# EAGLE design Controller_2.3_Atmega2560 (EAGLE 7.7.0)
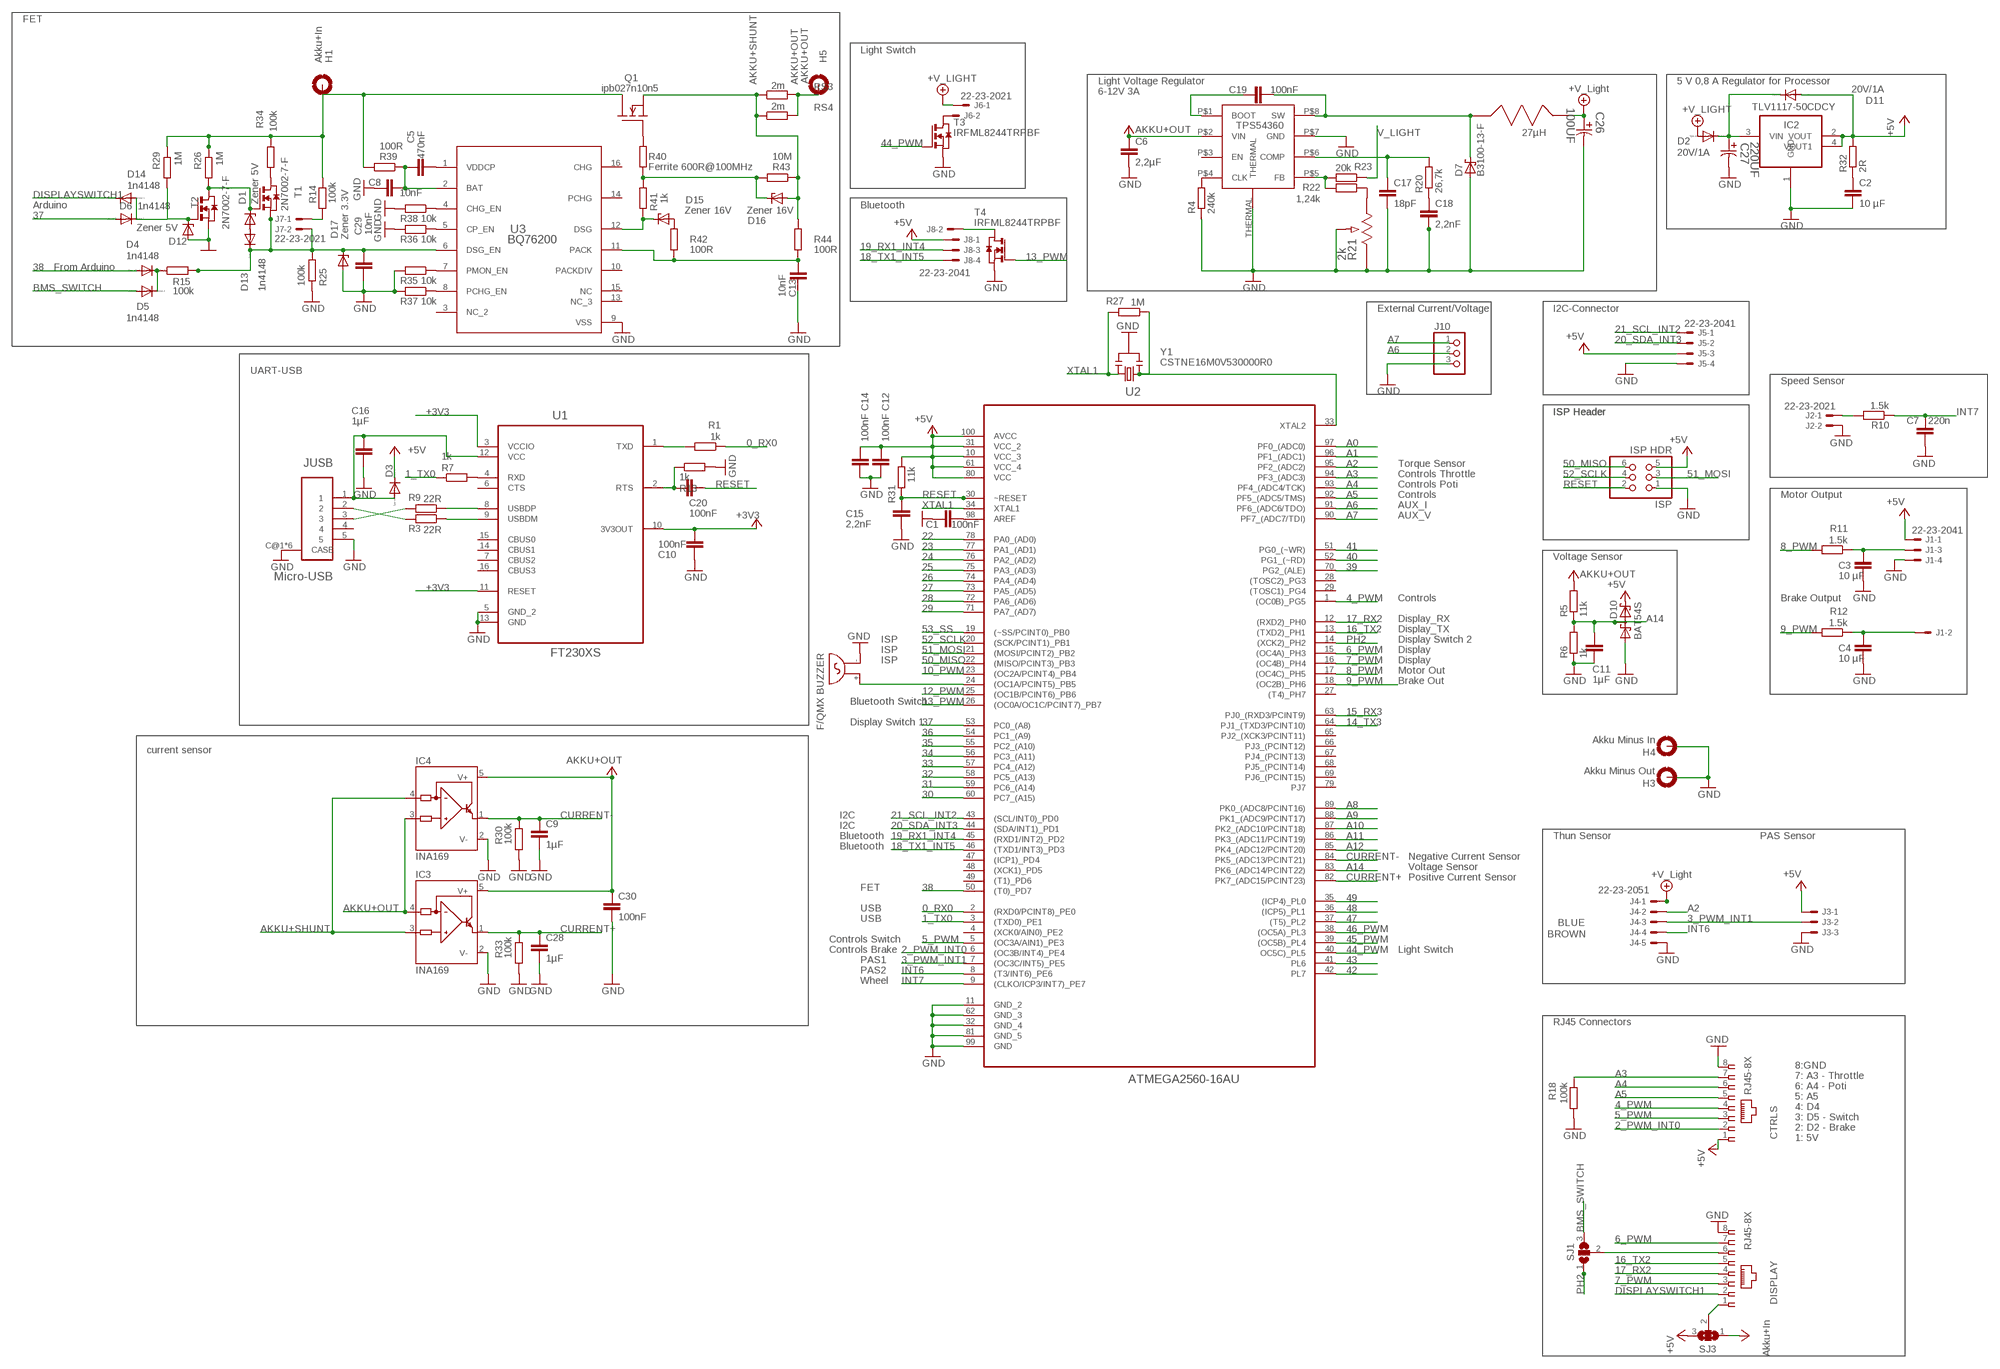
[diagram p0: schematic, sheet 1]

## Parts
BUZZER  F/QMX  [F/QMX]
C1  100nF  C-EUC0603  [C0603]
C2  10 µF  C-EUC1206  [C1206]
C3  10 µF  C-EUC1206  [C1206]
C4  10 µF  C-EUC1206  [C1206]
C5  470nF  C-EUC0603  [C0603]
C6  2,2µF  C-EUC1210  [C1210]
C7  220n  C-EUC0603  [C0603]
C8  10nF  C-EUC0603  [C0603]
C9  1µF  C-EUC0603  [C0603]
C10  100nF  C-EUC0603  [C0603]
C11  1µF  C-EUC0603  [C0603]
C12  100nF  C-EUC0603  [C0603]
C13  10nF  C-EUC0603  [C0603]
C14  100nF  C-EUC0603  [C0603]
C15  2,2nF  C-EUC0603  [C0603]
C16  1µF  C-EUC0603  [C0603]
C17  18pF  C-EUC0603  [C0603]
C18  2,2nF  C-EUC0603  [C0603]
C19  100nF  C-EUC0603  [C0603]
C20  100nF  C-EUC0603  [C0603]
C26  100UF  EEE-FPE101XAP-CASE-D8  [CAPAE660X800N]
C27  220UF  EEE-FPC221XAP-CASE-D8  [CAPAE660X800N]
C28  1µF  C-EUC0603  [C0603]
C29  10nF  C-EUC0603  [C0603]
C30  100nF  C-EUC0603  [C0603]
CTRLS  RJ45-8X  [RJ45-NO-SHIELD]
D1  Zener 5V  ZENER-DIODESOD323-W  [SOD323-W]
D2  20V/1A  DIODE-DO-214AC  [DO-214AC]
D3  20V/1A  DIODE-DO-214AC  [DO-214AC]
D4  1n4148  DIODE-SOD323-W  [SOD323-W]
D5  1n4148  DIODE-SOD323-W  [SOD323-W]
D6  1n4148  DIODE-SOD323-W  [SOD323-W]
D7  B3100-13-F  SCHOTTKY-DIODESMC  [SMC]
D10  BAT54S  [SOT23]
D11  20V/1A  DIODE-DO-214AC  [DO-214AC]
D12  Zener 5V  ZENER-DIODESOD323-W  [SOD323-W]
D13  1n4148  DIODE-SOD323-W  [SOD323-W]
D14  1n4148  DIODE-SOD323-W  [SOD323-W]
D15  Zener 16V  ZENER-DIODESOD323-W  [SOD323-W]
D16  Zener 16V  ZENER-DIODESOD323-W  [SOD323-W]
D17  Zener 3.3V  ZENER-DIODESOD323-W  [SOD323-W]
DISPLAY  RJ45-8X  [RJ45-NO-SHIELD]
H1  Akku+In  MOUNT-PAD-ROUND2.8  [2,8-PAD]
H3  Akku Minus Out  MOUNT-PAD-ROUND2.8  [2,8-PAD]
H4  Akku Minus In  MOUNT-PAD-ROUND2.8  [2,8-PAD]
H5  AKKU+OUT  MOUNT-PAD-ROUND2.8  [2,8-PAD]
IC2  TLV1117-50CDCY  REG1117  [SOT223]
IC3  INA169  INA168  [SOT23-5]
IC4  INA169  INA168  [SOT23-5]
ISP  ISP HDR  PINHD-2X3  [2X03]
J1  22-23-2041  [22-23-2041]
J2  22-23-2021  [22-23-2021]
J3  22-23-2031  [22-23-2031]
J4  22-23-2051  [22-23-2051]
J5  22-23-2041  [22-23-2041]
J6  22-23-2021  [22-23-2021]
J7  22-23-2021  [22-23-2021]
J8  22-23-2041  [22-23-2041]
J10  PINHD-1X3  [1X03]
JUSB  Micro-USB  47346-0001  [MOLEX_47346-0001]
Q1  ipb027n10n5  IRF510D2PAK  [D2PAK]
R1  1k  R-EU_R0603  [R0603]
R3  22R  R-EU_R0603  [R0603]
R4  240k  R-EU_R0603  [R0603]
R5  11k  R-EU_R0603  [R0603]
R6  1k  R-EU_R0603  [R0603]
R7  1k  R-EU_R0603  [R0603]
R9  22R  R-EU_R0603  [R0603]
R10  1.5k  R-EU_R0603  [R0603]
R11  1.5k  R-EU_R0603  [R0603]
R12  1.5k  R-EU_R0603  [R0603]
R13  1k  R-EU_R0603  [R0603]
R14  100k  R-EU_R0603  [R0603]
R15  100k  R-EU_R0603  [R0603]
R18  100k  R-EU_R0603  [R0603]
R20  26,7k  R-EU_R0603  [R0603]
R21  2k  EVM3WSX80B23-3W  [POT_EVM3W]
R22  1,24k  R-EU_R0603  [R0603]
R23  20k  R-EU_R0603  [R0603]
R25  100k  R-EU_R0603  [R0603]
R26  1M  R-EU_R0603  [R0603]
R27  1M  R-EU_R0603  [R0603]
R29  1M  R-EU_R0603  [R0603]
R30  100k  R-EU_R0603  [R0603]
R31  11k  R-EU_R0603  [R0603]
R32  2R  R-EU_R0603  [R0603]
R33  100k  R-EU_R0603  [R0603]
R34  100k  R-EU_R0603  [R0603]
R35  10k  R-EU_R0603  [R0603]
R36  10k  R-EU_R0603  [R0603]
R37  10k  R-EU_R0603  [R0603]
R38  10k  R-EU_R0603  [R0603]
R39  100R  R-EU_R0603  [R0603]
R40  Ferrite 600R@100MHz  R-EU_R0603  [R0603]
R41  1k  R-EU_R0603  [R0603]
R42  100R  R-EU_R0603  [R0603]
R43  10M  R-EU_R0603  [R0603]
R44  100R  R-EU_R0603  [R0603]
RS3  2m  R-EU_R2512  [R2512]
RS4  2m  R-EU_R2512  [R2512]
SJ1  SJ2W  [SJ_2]
SJ3  SJ2W  [SJ_2]
T1  2N7002-7-F  NMOSSOT23  [SOT-23]
T2  2N7002-7-F  NMOSSOT23  [SOT-23]
T3  IRFML8244TRPBF  NMOSSOT23  [SOT-23]
T4  IRFML8244TRPBF  NMOSSOT23  [SOT-23]
U1  FT230XS  [SOP63P600X175-16N]
U2  ATMEGA2560-16AU  [QFP50P1600X1600X120-100N]
U3  BQ76200  BQ76200PWR  [PW0016A_N]
U9  SRR1260-270M  [ARR1260]
U11  TPS54360  [R-PDSO-G8]
Y1  CSTNE16M0V530000R0  RESONATORMU  [RESONATOR]

## Nets
0_RX0: R1.1 U2.2((RXD0/PCINT8)_PE0)
1_TX0: R7.1 U2.3((TXD0)_PE1)
2_PWM_INT0: CTRLS.2 U2.6((OC3B/INT4)_PE4)
3_PWM_INT1: J3.2 J4.3 U2.7((OC3C/INT5)_PE5)
4_PWM: CTRLS.4 U2.1((OC0B)_PG5)
5_PWM: CTRLS.3 U2.5((OC3A/AIN1)_PE3)
6_PWM: DISPLAY.7 U2.15((OC4A)_PH3)
7_PWM: DISPLAY.3 U2.16((OC4B)_PH4)
8_PWM: R11.2 U2.17((OC4C)_PH5)
9_PWM: R12.2 U2.18((OC2B)_PH6)
10_PWM: U2.23((OC2A/PCINT4)_PB4)
12_PWM: U2.25((OC1B/PCINT6)_PB6)
13_PWM: T4.3(G) U2.26((OC0A/OC1C/PCINT7)_PB7)
14_TX3: U2.64(PJ1_(TXD3/PCINT10))
15_RX3: U2.63(PJ0_(RXD3/PCINT9))
16_TX2: DISPLAY.5 U2.13((TXD2)_PH1)
17_RX2: DISPLAY.4 U2.12((RXD2)_PH0)
18_TX1_INT5: J8.4 U2.46((TXD1/INT3)_PD3)
19_RX1_INT4: J8.3 U2.45((RXD1/INT2)_PD2)
20_SDA_INT3: J5.2 U2.44((SDA/INT1)_PD1)
21_SCL_INT2: J5.1 U2.43((SCL/INT0)_PD0)
22: U2.78(PA0_(AD0))
23: U2.77(PA1_(AD1))
24: U2.76(PA2_(AD2))
25: U2.75(PA3_(AD3))
26: U2.74(PA4_(AD4))
27: U2.73(PA5_(AD5))
28: U2.72(PA6_(AD6))
29: U2.71(PA7_(AD7))
30: U2.60(PC7_(A15))
31: U2.59(PC6_(A14))
32: U2.58(PC5_(A13))
33: U2.57(PC4_(A12))
34: U2.56(PC3_(A11))
35: U2.55(PC2_(A10))
36: U2.54(PC1_(A9))
37: D6.A U2.53(PC0_(A8))
38: D4.A U2.50((T0)_PD7)
39: U2.70(PG2_(ALE))
40: U2.52(PG1_(~RD))
41: U2.51(PG0_(~WR))
42: U2.42(PL7)
43: U2.41(PL6)
44_PWM: T3.3(G) U2.40(OC5C)_PL5)
45_PWM: U2.39((OC5B)_PL4)
46_PWM: U2.38((OC5A)_PL3)
47: U2.37((T5)_PL2)
48: U2.36((ICP5)_PL1)
49: U2.35((ICP4)_PL0)
50_MISO: ISP.6 U2.22((MISO/PCINT3)_PB3)
51_MOSI: ISP.3 U2.21((MOSI/PCINT2)_PB2)
52_SCLK: ISP.4 U2.20((SCK/PCINT1)_PB1)
53_SS: U2.19((~SS/PCINT0)_PB0)
+3V3: C10.2 U1.3(VCCIO) U1.10(3V3OUT) U1.11(RESET)
+5V: C12.2 C14.2 CTRLS.1 D3.C D10.2(C2) D11.A IC2.2(VOUT) IC2.4(VOUT1) ISP.5 J1.1 J3.1 J5.3 J8.1 R31.2 R32.2 SJ3.3 U2.10(VCC_3) U2.31(VCC_2) U2.61(VCC_4) U2.80(VCC) U2.100(AVCC)
A0: U2.97(PF0_(ADC0))
A1: U2.96(PF1_(ADC1))
A2: J4.2 U2.95(PF2_(ADC2))
A3: CTRLS.7 R18.1 U2.94(PF3_(ADC3))
A4: CTRLS.6 U2.93(PF4_(ADC4/TCK))
A5: CTRLS.5 U2.92(PF5_(ADC5/TMS))
A6: J10.2 U2.91(PF6_(ADC6/TDO))
A7: J10.1 U2.90(PF7_(ADC7/TDI))
A8: U2.89(PK0_(ADC8/PCINT16))
A9: U2.88(PK1_(ADC9/PCINT17))
A10: U2.87(PK2_(ADC10/PCINT18))
A11: U2.86(PK3_(ADC11/PCINT19))
A12: U2.85(PK4_(ADC12/PCINT20))
A14: C11.1 D10.3(C1A2) R5.1 R6.2 U2.83(PK6_(ADC14/PCINT22))
AKKU+IN: H1.B2,8(MOUNT) Q1.2(D) R14.2 R26.1 R29.1 R34.1 R39.2 SJ3.1 ; supply symbol labelled Akku+In
AKKU+OUT: C6.1 C30.1 H5.B2,8(MOUNT) IC3.4(IN-) IC3.5(V+) IC4.3(IN+) IC4.5(V+) R5.2 RS3.2 RS4.2 U11.P$2(VIN)
AKKU+SHUNT: D16.A IC3.3(IN+) IC4.4(IN-) Q1.3(S) R43.1 R44.2 RS3.1 RS4.1
BMS_SWITCH: D5.A SJ1.3
CURRENT+: C28.1 IC3.1(OUT) R33.2 U2.82(PK7_(ADC15/PCINT23))
CURRENT-: C9.1 IC4.1(OUT) R30.2 U2.84(PK5_(ADC13/PCINT21))
DISPLAYSWITCH1: D14.C DISPLAY.2
GND: BUZZER.- C1.2 C2.2 C3.2 C4.2 C6.2 C7.2 C8.1 C9.2 C10.1 C11.2 C12.1 C13.1 C14.1 C15.2 C16.2 C17.2 C18.2 C26.2 C27.2 C28.2 C29.1 C30.2 CTRLS.8 D7.A D10.1(A1) D12.A D17.A DISPLAY.8 H3.B2,8(MOUNT) H4.B2,8(MOUNT) IC2.1(GND) IC3.2(V-) IC4.2(V-) ISP.1 J1.4 J2.2 J3.3 J4.5 J5.4 J10.3 JUSB.5 JUSB.C@1(CASE) JUSB.C@2(CASE) JUSB.C@3(CASE) JUSB.C@4(CASE) JUSB.C@5(CASE) JUSB.C@6(CASE) R4.1 R6.1 R13.2 R18.2 R21.1 R21.2 R25.1 R30.1 R33.1 R35.2 R36.2 R37.2 R38.2 T2.2(S) T3.2(S) T4.2(S) U1.5(GND_2) U1.13(GND) U2.11(GND_2) U2.32(GND_4) U2.62(GND_3) U2.81(GND_5) U2.99(GND) U3.9(VSS) U11.P$7(GND) U11.THERMAL Y1.2
INT6: J4.4 U2.8((T3/INT6)_PE6)
INT7: C7.1 R10.1 U2.9((CLKO/ICP3/INT7)_PE7)
N$1: J6.2 T3.1(D)
N$2: R4.2 U11.P$4(CLK)
N$3: C16.1 D3.A JUSB.1 U1.12(VCC)
N$4: C1.1 U2.98(AREF)
N$5: J8.2 T4.1(D)
N$6: C20.1 R13.1 U1.2(RTS)
N$7: R3.1 U1.9(USBDM)
N$8: R9.1 U1.8(USBDP)
N$9: R1.2 U1.1(TXD)
N$10: JUSB.2 R3.2
N$11: C2.1 R32.1
N$12: R7.2 U1.4(RXD)
N$13: R21.3 R22.1
N$14: J2.1 R10.2
N$15: JUSB.3 R9.2
N$16: D1.A D13.A
N$17: C18.1 R20.1
N$18: C17.1 R20.2 U11.P$6(COMP)
N$19: BUZZER.+ U2.24((OC1A/PCINT5)_PB5)
N$24: R34.2 T1.1(D)
N$25: R37.1 U3.8(PCHG_EN)
N$28: R22.2 R23.2 U11.P$5(FB)
N$29: D4.C D5.C R15.1
N$30: R35.1 U3.7(PMON_EN)
N$31: C3.1 J1.3 R11.1
N$32: C4.1 J1.2 R12.1
N$33: C19.2 D7.C U9.P$1 U11.P$8(SW)
N$34: DISPLAY.1 SJ3.2
N$35: J7.1 R14.1
N$37: C27.1 D2.C D11.C IC2.3(VIN)
N$38: R36.1 U3.5(CP_EN)
N$40: R38.1 U3.4(CHG_EN)
N$41: C5.2 U3.1(VDDCP)
N$42: D1.C R26.2 T1.3(G) T2.1(D)
N$44: C19.1 U11.P$1(BOOT)
N$45: C5.1 C8.2 R39.1 U3.2(BAT)
N$46: C29.2 D13.C D17.C J7.2 R15.2 R25.2 T1.2(S) U3.6(DSG_EN)
N$47: DISPLAY.6 SJ1.2
N$48: D15.A R42.2
N$49: D6.C D12.C D14.A R29.2 T2.3(G)
N$51: C13.2 R42.1 R44.1 U3.11(PACK)
N$52: Q1.1(G) R40.2
N$53: D16.C R40.1 R41.2 R43.2
N$54: D15.C R41.1 U3.12(DSG)
N$56: R27.1 U2.33(XTAL2) Y1.1
PH2: SJ1.1 U2.14((XCK2)_PH2)
RESET: C15.1 C20.2 ISP.2 R31.1 U2.30(~RESET)
V_LIGHT: C26.1 D2.A J4.1 J6.1 R23.1 U9.P$2 ; supply symbol labelled +V_LIGHT, +V_Light
XTAL1: R27.2 U2.34(XTAL1) Y1.3
Unconnected: JUSB.4 U1.6(CTS) U1.7(CBUS2) U1.14(CBUS1) U1.15(CBUS0) U1.16(CBUS3) U2.4((XCK0/AIN0)_PE2) U2.27((T4)_PH7) U2.28((TOSC2)_PG3) U2.29((TOSC1)_PG4) U2.47((ICP1)_PD4) U2.48((XCK1)_PD5) U2.49((T1)_PD6) U2.65(PJ2_(XCK3/PCINT11)) U2.66(PJ3_(PCINT12)) U2.67(PJ4_(PCINT13)) U2.68(PJ5_(PCINT14)) U2.69(PJ6_(PCINT15)) U2.79(PJ7) U3.3(NC_2) U3.10(PACKDIV) U3.13(NC_3) U3.14(PCHG) U3.15(NC) U3.16(CHG) U11.P$3(EN)

## Notes on the sheet
- FET
- Light Switch
- Light Voltage Regulator | 5 V 0,8 A Regulator for Processor
- 6-12V 3A
- TPS54360
- 27µH
- Arduino | Bluetooth
- From Arduino
- External Current/Voltage | I2C-Connector
- UART-USB
- Speed Sensor
- ISP Header | ISP Header
- Torque Sensor
- Controls Throttle
- Controls Poti
- Controls | Motor Output
- AUX_I
- AUX_V
- Voltage Sensor
- Controls | Brake Output
- Display_RX
- Display_TX
- ISP | Display Switch 2
- ISP | Display
- ISP | Display
- Motor Out
- Brake Out
- Bluetooth Switch
- Display Switch 1
- current sensor
- I2C
- I2C
- Bluetooth | Thun Sensor | PAS Sensor
- Bluetooth
- Negative Current Sensor
- Voltage Sensor
- Positive Current Sensor
- FET
- USB
- BLUE
- USB
- BROWN
- Controls Switch
- Controls Brake | Light Switch
- PAS1
- PAS2
- Wheel
- RJ45 Connectors
- 8:GND
- 7: A3 - Throttle
- 6: A4 - Poti
- 5: A5
- 4: D4
- 3: D5 - Switch
- 2: D2 - Brake
- 1: 5V

## Library data of the parts
BUZZER = buzzer:F/QMX: BUZZER Source: Buerklin; OC_FARNELL: unknown; OC_NEWARK: unknown
C1-C20 C28-C30 = rcl:C-EU: CAPACITOR, European symbol
C26 = Panasonic-EEEFK_EEEFP:EEE-: Aluminum Electrolytic Capacitors,Surface Mount Type; MPN: EEE-FPE101XAP; OC_FARNELL: 1539488; OC_NEWARK: 94M6995; PACKAGE: CASE-D8; SUPPLIER: PANASONIC; TOLERANCE: ±20 %; VOLTAGERATING: 25V
C27 = Panasonic-EEEFK_EEEFP:EEE-: Aluminum Electrolytic Capacitors,Surface Mount Type; MPN: EEE-FPC221XAP; OC_FARNELL: 1539479; OC_NEWARK: 94M6992; PACKAGE: CASE-D8; SUPPLIER: PANASONIC; TOLERANCE: ±20 %; VOLTAGERATING: 16V
CTRLS DISPLAY = con-tycoelectronics:RJ45: CORCOM Modular RJ Jacks No Shield Source: www.tycoelectronics.com .. ENG_DS_1654001_1099_RJ_L_0507.pdf; MPN: RJ45-8X; OC_FARNELL: unknown; OC_NEWARK: 16R6101
D1 D12 D15-D17 = diode:ZENER-DIODE: Z-Diode
D2-D6 D11 D13 D14 = diode:DIODE-: DIODE
D7 = diode:SCHOTTKY-DIODE: Schottky Diode
D10 = diode:BAT54S: Schottky Diodes Pin connection corrected 2011-05-04 Source: Fairchild .. BAT54.pdf
H1 H3-H5 = holes:MOUNT-PAD-ROUND: MOUNTING PAD, round
IC2 = burr-brown:REG1117: 800mA and 1A Low Dropout (LDO) Positive Regulator 1.8V, 2.5V, 2.85V, 3.3V, 5V, and Adj; MPN: REG1117; OC_FARNELL: 1097566; OC_NEWARK: 14P6981
IC3 IC4 = burr-brown:INA168: High-Side Measurement Current Shunt Monitor; MF: TEXAS INSTRUMENTS; MPN: INA168NA/250; OC_FARNELL: 4375737; OC_NEWARK: 35C1744
ISP = pinhead:PINHD-2X3: PIN HEADER
J1 J5 J8 = con-molex:22-23-2041: .100" (2.54mm) Center Header - 4 Pin; MF: MOLEX; MPN: 22-23-2041; OC_FARNELL: 1462920; OC_NEWARK: 38C0355
J2 J6 J7 = con-molex:22-23-2021: .100" (2.54mm) Center Header - 2 Pin; MF: MOLEX; MPN: 22-23-2021; OC_FARNELL: 1462926; OC_NEWARK: 25C3832
J3 = con-molex:22-23-2031: .100" (2.54mm) Center Header - 3 Pin; MF: MOLEX; MPN: 22-23-2031; OC_FARNELL: 1462950; OC_NEWARK: 30C0862
J4 = con-molex:22-23-2051: .100" (2.54mm) Center Header - 5 Pin; MF: MOLEX; MPN: 22-23-2051; OC_FARNELL: 1462952; OC_NEWARK: 38C9178
J10 = pinhead:PINHD-1X3: PIN HEADER
JUSB = Molex-47346-0001:47346-0001: CONN RCPT 5POS MICRO USB R/A SMD; MPN: 47346-0001; OC_FARNELL: 1568026; OC_NEWARK: 47M0505; PACKAGE: 5 POS MICRO USB R/A; SUPPLIER: MOLEX
Q1 = D2PAK:IRF510: N-Channel Enhancement MOSFET (HEXFET); 100V; 5,6A; 0,54Ohm
R1 R3 R4 R7 R9-R15 R18 R20 R22 R23 R25 R26 R29 R30 R32-R44 RS3 RS4 = rcl:R-EU_: RESISTOR, European symbol
R5 R6 R27 R31 = resistor:R-EU_: RESISTOR, European symbol
R21 = Panasonic-Trimmer_Potentiometers:EVM: Potentiometers; MPN: EVM3WSX80B23; OC_FARNELL: 1849784; OC_NEWARK: 93T1522; PACKAGE: EVM3W; POWERRATING: 0.15W; SUPPLIER: PANASONIC; TOLERANCE: ±25 %; VALUE: 2KOHM
SJ1 SJ3 = jumper:SJ2W: SMD solder JUMPER
T1-T4 = zetex:NMOSSOT23: MOS FET; OC_FARNELL: unknown; OC_NEWARK: unknown
U1 = FTDI_FT230XS:FT230XS: I/F, USB2.0 FS TO BASIC UART; MPN: FT230XS; OC_FARNELL: 2081321; OC_NEWARK: 83T7087; PACKAGE: SSOP-16; SUPPLIER: FTDI
U2 = Atmega2560:ATMEGA2560-16AU: Microcontroller; DESCRIPTION: Microcontroller; MPN: ATMEGA2560-16AU; OC_FARNELL: 1288330; OC_NEWARK: 23M5051; PACKAGE: LQFP-100; SUPPLIER: ATMEL
U3 = BQ76200:BQ76200PWR; ALTERNATEPARTNUMBER: BQ76200PW; APPLICATION_BUILDNUMBER: *; COMPTYPE: IC; MANUFACTURER: Texas Instruments; MOUNTTYPE: SMT; PACKAGEREFERENCE: PW0016A; PARTNUMBER: BQ76200PWR; PIN_COUNT: 16; REFDES: RefDes; ROHS: Y; TYPE: TYPE; VALUE: Value
U9 = Bourns_SRR1260-270M:SRR1260-270M
U11 = TI_TPS54360:TPS54360
Y1 = CSTNE16M0V530000R0:RESONATOR

## Net classes
1 clearance: clearance 2.54 mm

## Board
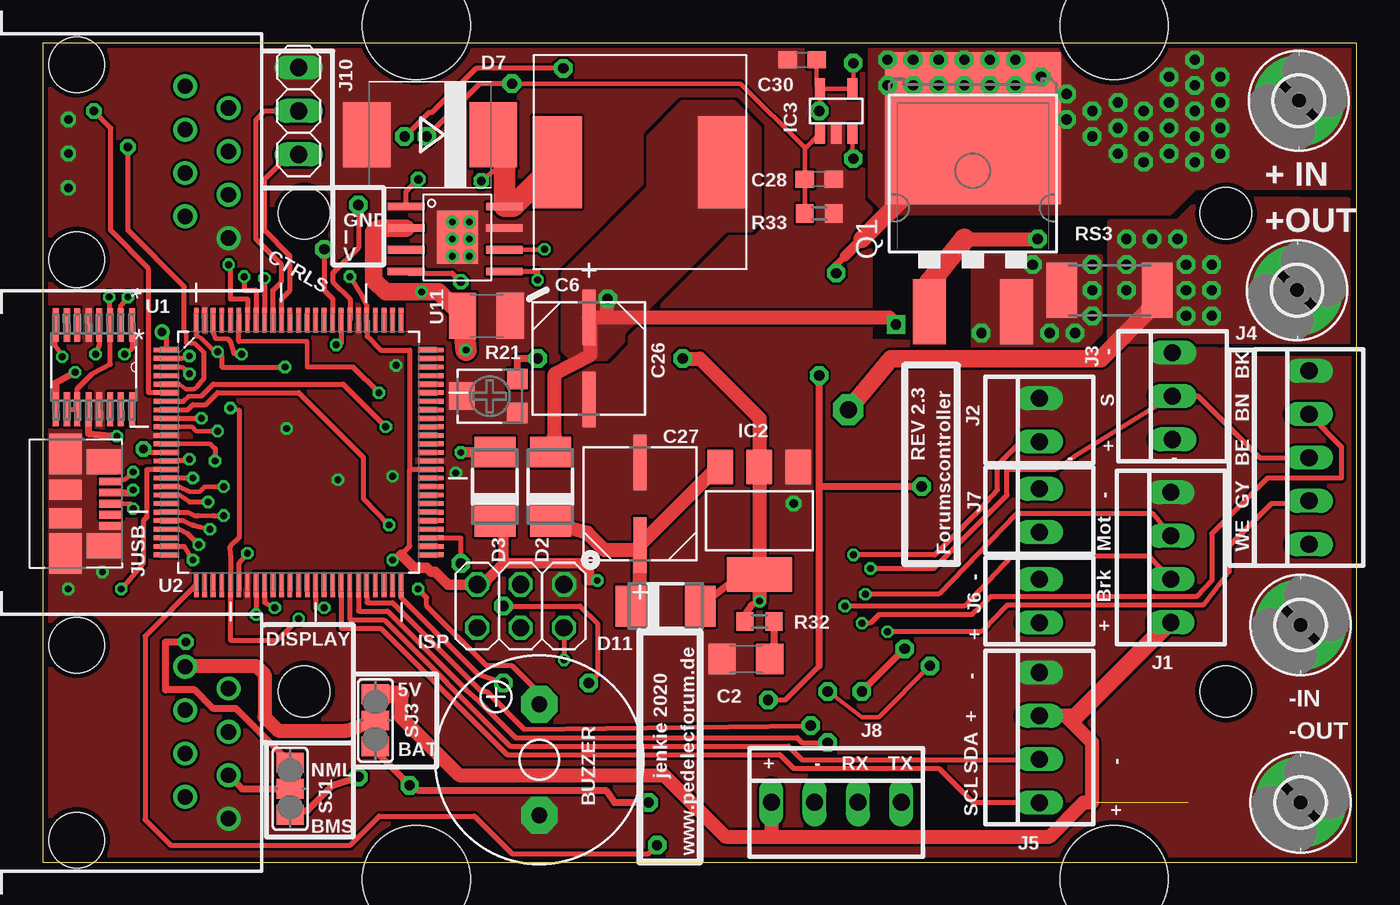
[diagram p1: board, top side]
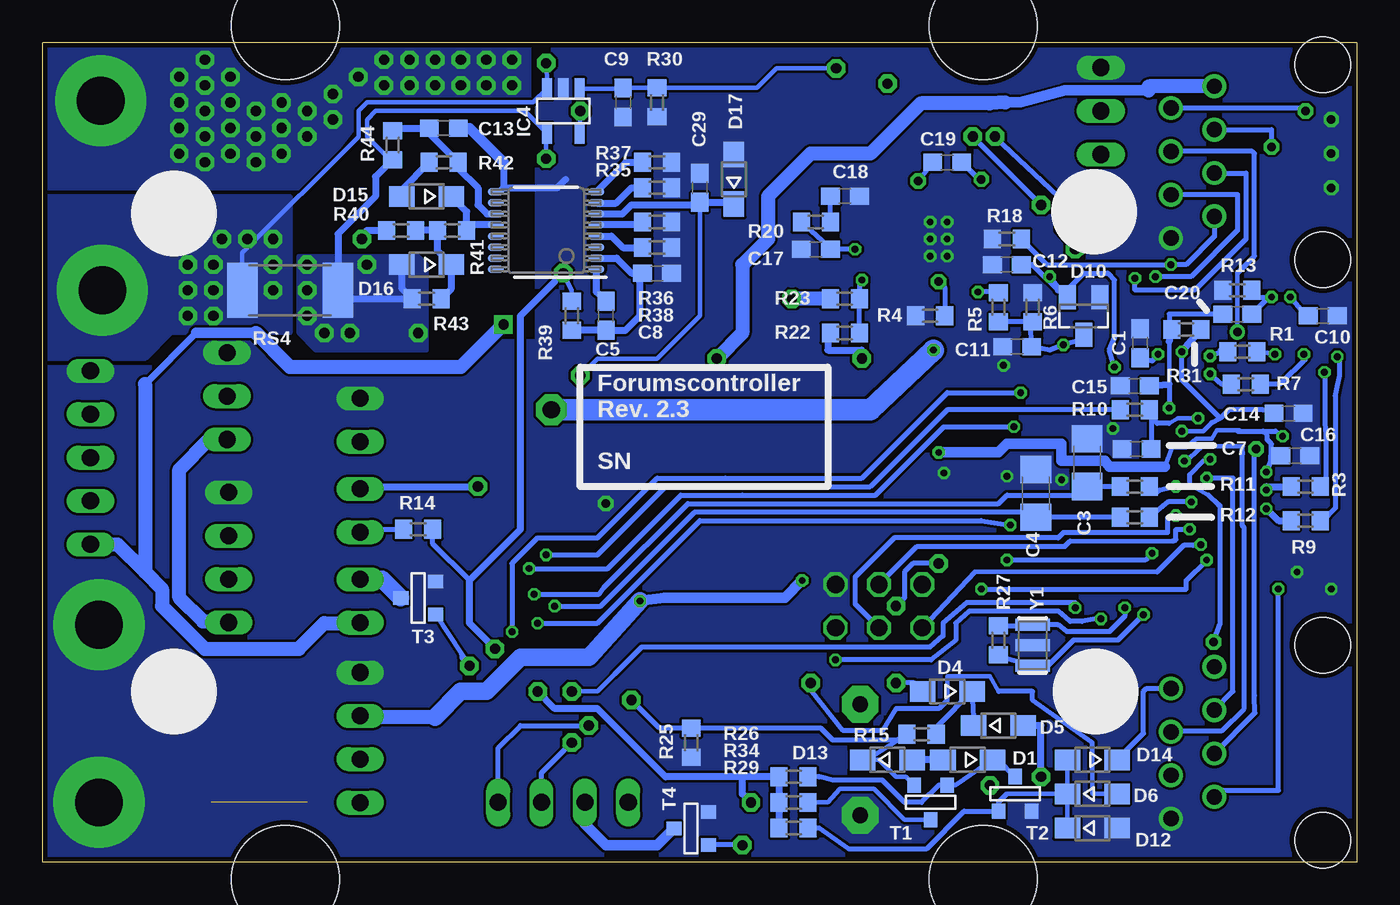
[diagram p2: board, bottom side, seen from below]

Size 77 x 48 mm. Coordinates in mm from the lower left corner, seen from the top.
Outline: 0,0 77,0 77,48 0,48 0,0
Copper layers (1*16): Top 0.035mm / dielectric 1.5mm / Bottom 0.035mm
Design rules "PCB-POOL Standard": minimum track width 0.15mm, minimum drill 0.3mm, track to track 0.15mm, track to pad 0.15mm, pad to pad 0.15mm, via to via 0.15mm, smd to smd 0.15mm, copper to edge 0.3mm, drill to drill 0.2mm, minimum pad ring 0.2mm, minimum via ring 0.15mm, stop-mask expansion 0.075mm, vias tented up to drill 0mil, thermal gap 0.2mm

### Footprints (pad centres in the part's own frame; a part is rotated, then mirrored left to right if it is on the bottom)
F/QMX = drill 0.914 pad 2.159 octagon: + 3.251,0; - -3.251,0
C0603 = smd 1.1 x 1: 1 -0.85,0; 2 0.85,0
C1206 = smd 1.6 x 1.8: 1 -1.4,0; 2 1.4,0
C1210 = smd 1.6 x 2.7: 1 -1.4,0; 2 1.4,0
CAPAE660X800N = smd 3.251 x 0.762: 1 -2.413,0; 2 2.413,0
RJ45-NO-SHIELD = drill 0.9 pad 1.4: 1 -4.445,6.35; 2 -3.175,8.89; 3 -1.905,6.35; 4 -0.635,8.89; 5 0.635,6.35; 6 1.905,8.89; 7 3.175,6.35; 8 4.445,8.89 | hole 3.251: -5.715,0; 5.715,0
SOD323-W = smd 1.5 x 1.2: A 1.45,0; C -1.45,0
DO-214AC = smd 1.8 x 2.4: A 2.025,0; C -2.025,0
SMC = smd 2.8 x 3.8: A 3.7,0; C -3.7,0
SOT23 = smd 1 x 1.4: 1 -0.95,-1.1; 2 0.95,-1.1; 3 0,1.1
2,8-PAD = drill 2.8 pad 5.334: B2,8 0,0
SOT223 = smd 1.499 x 2.007: 1 -2.261,-3.15; 2 0.025,-3.15; 3 2.311,-3.15 | smd 3.81 x 2.007: 4 0,3.15
SOT23-5 = smd 0.6 x 1.2: 1 -0.95,-1.306; 2 0,-1.306; 3 0.95,-1.306; 4 0.95,1.306; 5 -0.95,1.306
2X03 = drill 1.016 octagon: 1 -2.54,-1.27; 2 -2.54,1.27; 3 0,-1.27; 4 0,1.27; 5 2.54,-1.27; 6 2.54,1.27
22-23-2041 = drill 1 long: 1 -3.81,0; 2 -1.27,0; 3 1.27,0; 4 3.81,0
22-23-2021 = drill 1 long: 1 -1.27,0; 2 1.27,0
22-23-2031 = drill 1 long: 1 -2.54,0; 2 0,0; 3 2.54,0
22-23-2051 = drill 1 long: 1 -5.08,0; 2 -2.54,0; 3 0,0; 4 2.54,0; 5 5.08,0
1X03 = drill 1.016 long: 1 -2.54,0; 2 0,0; 3 2.54,0
MOLEX_47346-0001 = smd 0.45 x 1.38: 1 -1.3,0; 2 -0.65,0; 3 0,0; 4 0.65,0; 5 1.3,0 | smd 1.475 x 2.1: C@1 -2.462,-0.36; C@2 2.462,-0.36 | smd 2.375 x 1.9: C@3 -2.913,-2.66; C@6 2.913,-2.66 | smd 1.175 x 1.9: C@4 -0.82,-2.66; C@5 0.85,-2.66
D2PAK = smd 1.93 x 3.81: 1 -2.55,-8.25; 3 2.55,-8.25 | smd 10.3 x 8.9: 2 0,2.5
R0603 = smd 1 x 1.1: 1 -0.85,0; 2 0.85,0
POT_EVM3W = smd 1.194 x 1.194: 1 -0.991,-1.6; 3 0.991,-1.6 | smd 1.6 x 1.499: 2 0,1.651
R2512 = smd 1.8 x 3.2: 1 -2.8,0; 2 2.8,0
SJ_2 = smd 1.168 x 1.6: 1 -1.524,0; 2 0,0; 3 1.524,0
SOT-23 = smd 0.787 x 0.889: 1 0.025,-1.016; 2 -0.94,1.016; 3 0.991,1.016
SOP63P600X175-16N = smd 1.981 x 0.356: 1 -2.464,2.235; 2 -2.464,1.575; 3 -2.464,0.965; 4 -2.464,0.305; 5 -2.464,-0.305; 6 -2.464,-0.965; 7 -2.464,-1.575; 8 -2.464,-2.235; 9 2.464,-2.235; 10 2.464,-1.575; 11 2.464,-0.965; 12 2.464,-0.305; 13 2.464,0.305; 14 2.464,0.965; 15 2.464,1.575; 16 2.464,2.235
QFP50P1600X1600X120-100N = smd 1.473 x 0.279: 1 -7.747,5.994; 2 -7.747,5.512; 3 -7.747,5.004; 4 -7.747,4.496; 5 -7.747,3.988; 6 -7.747,3.505; 7 -7.747,2.997; 8 -7.747,2.489; 9 -7.747,2.007; 10 -7.747,1.499; 11 -7.747,0.991; 12 -7.747,0.508; 13 -7.747,0; 14 -7.747,-0.508; 15 -7.747,-0.991; 16 -7.747,-1.499; 17 -7.747,-2.007; 18 -7.747,-2.489; 19 -7.747,-2.997; 20 -7.747,-3.505; 21 -7.747,-3.988; 22 -7.747,-4.496; 23 -7.747,-5.004; 24 -7.747,-5.512; 25 -7.747,-5.994; 51 7.747,-5.994; 52 7.747,-5.512; 53 7.747,-5.004; 54 7.747,-4.496; 55 7.747,-3.988; 56 7.747,-3.505; 57 7.747,-2.997; 58 7.747,-2.489; 59 7.747,-2.007; 60 7.747,-1.499; 61 7.747,-0.991; 62 7.747,-0.508; 63 7.747,0; 64 7.747,0.508; 65 7.747,0.991; 66 7.747,1.499; 67 7.747,2.007; 68 7.747,2.489; 69 7.747,2.997; 70 7.747,3.505; 71 7.747,3.988; 72 7.747,4.496; 73 7.747,5.004; 74 7.747,5.512; 75 7.747,5.994 | smd 0.279 x 1.473: 26 -5.994,-7.747; 27 -5.512,-7.747; 28 -5.004,-7.747; 29 -4.496,-7.747; 30 -3.988,-7.747; 31 -3.505,-7.747; 32 -2.997,-7.747; 33 -2.489,-7.747; 34 -2.007,-7.747; 35 -1.499,-7.747; 36 -0.991,-7.747; 37 -0.508,-7.747; 38 0,-7.747; 39 0.508,-7.747; 40 0.991,-7.747; 41 1.499,-7.747; 42 2.007,-7.747; 43 2.489,-7.747; 44 2.997,-7.747; 45 3.505,-7.747; 46 3.988,-7.747; 47 4.496,-7.747; 48 5.004,-7.747; 49 5.512,-7.747; 50 5.994,-7.747; 76 5.994,7.747; 77 5.512,7.747; 78 5.004,7.747; 79 4.496,7.747; 80 3.988,7.747; 81 3.505,7.747; 82 2.997,7.747; 83 2.489,7.747; 84 2.007,7.747; 85 1.499,7.747; 86 0.991,7.747; 87 0.508,7.747; 88 0,7.747; 89 -0.508,7.747; 90 -0.991,7.747; 91 -1.499,7.747; 92 -2.007,7.747; 93 -2.489,7.747; 94 -2.997,7.747; 95 -3.505,7.747; 96 -3.988,7.747; 97 -4.496,7.747; 98 -5.004,7.747; 99 -5.512,7.747; 100 -5.994,7.747
PW0016A_N = smd 0.95 x 0.45: 1 -2.95,2.275; 2 -2.95,1.625; 3 -2.95,0.975; 4 -2.95,0.325; 5 -2.95,-0.325; 6 -2.95,-0.975; 7 -2.95,-1.625; 8 -2.95,-2.275; 9 2.95,-2.275; 10 2.95,-1.625; 11 2.95,-0.975; 12 2.95,-0.325; 13 2.95,0.325; 14 2.95,0.975; 15 2.95,1.625; 16 2.95,2.275
ARR1260 = smd 2.9 x 5.4: P$1 -4.85,0; P$2 4.85,0
R-PDSO-G8 = smd 0.45 x 2.15: P$1 3.81,0; P$2 2.54,0; P$3 1.27,0; P$4 0,0; P$5 0,-5.75; P$6 1.27,-5.75; P$7 2.54,-5.75; P$8 3.81,-5.75 | smd 3.1 x 2.4: THERMAL 2,-3
1593L = hole 3: 14.33,14; 14.33,-14; 68.33,14; 68.33,-14 | hole 6.3: 20.9,25; 20.9,-25; 61.77,25; 61.77,-25
RESONATOR = smd 0.7 x 2: 1 -1.2,0; 2 0,0; 3 1.2,0

### Placement (x,y rotation side)
BUZZER  29.1,6 90 top
C1  12.7,30.4 90 bottom
C2  41.2,11.9 180 top
C3  15.8,23.4 90 bottom
C4  18.8,21.6 90 bottom
C5  44,32 90 bottom
C6  26,32 0 top
C7  12.9,24.2 180 bottom
C8  41,34.5 180 bottom
C9  43,44.5 270 bottom
C10  2,32 180 bottom
C11  19.9,30.2 180 bottom
C12  20.5,35 0 bottom
C13  53.5,43 180 bottom
C14  4,26.3 180 bottom
C15  13,27.9 180 bottom
C16  3.6,23.8 0 bottom
C17  31.7,35.9 180 bottom
C18  30,39 0 bottom
C19  24,41 180 bottom
C20  7,32.1 180 bottom
C26  32,29.5 270 top
C27  35,21 90 top
C28  45.5,40 0 top
C29  38.5,39.5 270 bottom
C30  44.5,47 180 top
CTRLS  2,41 270 top
D1  22.8,6 180 bottom
D2  29.75,22 90 top
D3  26.5,22 90 top
D4  24,10 180 bottom
D5  21,8 0 bottom
D6  15.5,4 0 bottom
D7  22.7,42.6 180 top
D10  16,32 180 bottom
D11  36.5,15 0 top
D12  15.5,2 0 bottom
D13  27.5,6 0 bottom
D14  15.5,6 180 bottom
D15  54.5,39 180 bottom
D16  54.5,35 180 bottom
D17  36.5,40 90 bottom
DISPLAY  2,7 270 top
H1  73.6,44.6 0 top
H3  73.7,3.5 0 top
H4  73.7,13.9 0 top
H5  73.5,33.5 0 top
IC2  42,20 180 top
IC3  46.5,44 0 top
IC4  46.5,44 180 bottom
ISP  28,15 180 top
J1  66.1,17.85 90 top
J2  58.4,25.9 90 top
J3  66.2,27.3 90 top
J4  74.2,23.7 90 top
J5  58.4,7.3 90 top
J6  58.4,15.3 90 top
J7  58.4,20.6 90 top
J8  46.5,3.5 0 top
J10  15,44 90 top
JUSB  4,21 270 top
Q1  54.5,40.5 0 top
R1  6.7,29.9 0 bottom
R3  3,22 180 bottom
R4  25,32 0 bottom
R5  21,32.5 90 bottom
R6  19,32.5 270 bottom
R7  6.5,28 0 bottom
R9  3,20 180 bottom
R10  13,26.5 180 bottom
R11  13,22 0 bottom
R12  13,20.2 0 bottom
R13  7,33.5 180 bottom
R14  55,19.5 0 bottom
R15  25.5,7.5 180 bottom
R18  20.5,36.5 180 bottom
R20  31.7,37.5 180 bottom
R21  26.2,27.3 90 top
R22  30,31 0 bottom
R23  30,33 0 bottom
R25  39,7 90 bottom
R26  33,5 0 bottom
R27  21,13 90 bottom
R29  33,2 0 bottom
R30  41,44.5 90 bottom
R31  10,31.2 0 bottom
R32  42,14.1 180 top
R33  45.5,38 180 top
R34  33,3.5 0 bottom
R35  41,39.5 0 bottom
R36  41,37.5 0 bottom
R37  41,41 0 bottom
R38  41,36 0 bottom
R39  46,32 90 bottom
R40  56,37 180 bottom
R41  53,37 180 bottom
R42  53.5,41 180 bottom
R43  54.5,33 0 bottom
R44  56.5,42 270 bottom
RS3  62.5,33.5 0 top
RS4  62.5,33.5 180 bottom
SJ1  14.5,4.3 270 top
SJ3  19.5,8.3 90 top
T1  25,3.5 0 bottom
T2  20,4 180 bottom
T3  55,15.5 270 bottom
T4  39,2 270 bottom
U1  3,29 270 top
U2  15,24 0 top
U3  47.5,37 180 bottom
U9  35,41 0 top
U11  21.3,34.6 90 top
U$2  [1593L]  1,24 0 top
Y1  19,12.7 90 bottom

### Tracks (layer width: path | path; a pad name or v marks a point on that pad's centre or on a via)
0_RX0  (via drill 0.4)
  Top 0.305: U2.2 8.11,29.51 v8.6,29.65
  Bottom 0.305: 8,30 R1.1 7.95,29.9 v8.6,29.65
1_TX0  (via drill 0.4)
  Top 0.254: U2.3 8.2,29 v8.6,28.6
  Bottom 0.305: v8.6,28.6 7.9,28 R7.1
2_PWM_INT0  (via drill 0.5)
  Top 0.305: U2.6 6.2,27.5 6.2,34.75 4,37 4,43 v3,44
  Bottom 0.305: 3.15,44 v3,44 3,44.17 CTRLS.2
3_PWM_INT1  (via drill 0.4)
  Top 0.25: 8.25,27 8.55,27.3 9.3,27.3
  Top 0.305: v48.5,17.2 52.2,17.2 56.5,21.5 56.5,23 59.25,23 59.75,23.25 60.5,23.8 J3.2 67.7,27.3 71.3,23.7 J4.3 | U2.7 8.25,27 | 9.3,27.3 10,28 17.6,28 v20.1,25.5
  Bottom 0.305: v48.5,17.2 43.9,17.2 39.6,21.5 36,21.5 28.2,21.5 24.2,25.5 v20.1,25.5
4_PWM  (via drill 0.5)
  Top 0.305: U2.1 7.25,30.75 v7,31.05
  Bottom 0.254: v7,31.05 7,34.5
  Bottom 0.305: 7,34.5 6,35.5 6,41.5 6.13,41.63 CTRLS.4
5_PWM  (via drill 0.5)
  Top 0.25: U2.5 8,28 8.4,27.7 8.89,27.7 9.09,27.89 | 9.45,29.85 8.9,30.4 8.4,30.4 8.4,31
  Top 0.305: 9.09,27.89 9.45,28.35 9.45,29.85 | 8.4,31 8.3,31.1 8.3,33.7 5,37 v5,41.9
  Bottom 0.305: 5,42.15 v5,41.9 5,42.91 CTRLS.3
6_PWM  (via drill 0.4)
  Top 0.305: U2.15 6.11,23.01 6.1,23 6.1,20.2 5.9,20 5.9,17.5 v4.6,16
  Bottom 0.305: v4.6,16 4.6,4.2 7.97,4.2 DISPLAY.7
7_PWM  (via drill 0.4)
  Top 0.305: v8.8,22.5 U2.16
  Bottom 0.305: v8.8,22.5 8.9,22.5 U2.16 7.25,10 DISPLAY.3
8_PWM  (via drill 0.4)
  Top 0.25: U2.17 8,21.99 8,22 8.6,21.7 9.2,21.7 9.5,22 v10.6,22
  Bottom 0.305: R11.2 11.75,21.6 11.55,21.8 v10.6,22
9_PWM  (via drill 0.4)
  Top 0.305: U2.18 7.99,21.51 8.6,21.1 v9.7,21.1
  Bottom 0.305: v9.7,21.1 11.05,21.1 R12.2
13_PWM  (via drill 0.6)
  Top 0.305: U2.26 6,13.25 6,2.5 7.5,1 18,1 19.7,2.7 25.3,2.7 27.5,0.5 35.5,0.5 v36,1
  Bottom 0.305: v36,1 v36.01,1.01 T4.3
16_TX2  (via drill 0.5)
  Top 0.305: v5.9,24.2 6.1,24.25 6.1,24 U2.13
  Bottom 0.305: v5.9,24.2 6,24.2 6,9.76 5.98,8.74 DISPLAY.5
17_RX2  (via drill 0.4)
  Top 0.254: U2.12 9.8,24.5 10.05,24.25 | 10.1,24.2 10.05,24.25 | 10.05,24.25 10.1,24.25
  Top 0.305: U2.12 | 10.1,24.25 10.1,24.2 v10.1,23.5
  Bottom 0.254: 6.7,24.35 9.05,24.35 9.8,23.7
  Bottom 0.305: 6.7,24.35 6.7,23.91 6.7,24.01 6.7,19.7 6.6,19.6 6.6,9 7.9,7.7 10.82,7.7 DISPLAY.4 | 9.8,23.7 v10.1,23.5
18_TX1_INT5  (via drill 0.6)
  Top 0.305: U2.46 18.99,15.51 19,15.5 19,15.2 20.5,15.2 25.7,10 26,10 28.2,7.8 v45,8
  Bottom 0.305: J8.4 50.31,6.69 49,8 v45,8
19_RX1_INT4  (via drill 0.6)
  Top 0.305: U2.45 18.5,14.71 18.5,14.7 20.2,14.7 24.8,10.1 25.5,9.5 27.7,7.3 44.2,7.3 44.5,7 v46,7
  Bottom 0.305: J8.3 47.77,5.23 v46,7
20_SDA_INT3
  Top 0.305: U2.44 18,14.2 18.2,14.2 20,14.2 27.4,6.8 43.7,6.8 44.5,6 58.37,6 J5.2
21_SCL_INT2
  Top 0.305: U2.43 17.49,13.71 17.5,13.7 19.8,13.7 27.2,6.3 43.2,6.3 44,5.5 52.5,5.5 54.5,3.5 J5.1
37  (via drill 0.6)
  Top 0.305: U2.53 23,19 23.01,19 24.5,19 v24.5,17.5 | v27,15 31.5,15 32.5,14 32.5,11 v32,10.5
  Bottom 0.254: 21,10 21.5,10.9 24,10.9 24,9.5 | D6.A 15.5,4 15.5,5.45
  Bottom 0.305: v24.5,17.5 26,17.5 26.5,17 26.5,15.5 v27,15 | 15.5,5.45 15.5,7 19,9.5 19,10 21,10 | 24,9.5 24.5,9 27,9 27.8,7.7 30.1,7.7 32,10.1 v32,10.5
38  (via drill 0.6)
  Top 0.305: U2.50 21,15.5 25.5,11 v27,10.5
  Bottom 0.305: D4.A 25.95,10.5 v27,10.5
44_PWM  (via drill 0.4, 0.6)
  Top 0.254: v46,10 48,8.5 49,8.5 v51.99,11.49 v51.99,11.5
  Top 0.305: U2.40 16,14.9 v16.5,14.9
  Bottom 0.254: 43.5,11 44.5,10 v46,10 | v51.99,11.5 52.46,11.96 52.46,12.2
  Bottom 0.305: T3.3 52.46,12.2 v51.99,11.5 | v16.5,14.9 16.5,15.2 22.85,15.2 24.25,14 24.25,13.25 25,12.6 41.9,12.6 43.5,11
50_MISO  (via drill 0.4)
  Top 0.305: U2.22 8,19.5 8.5,19.25 v9.15,18.6
  Bottom 0.25: 11.7,17 22.39,17
  Bottom 0.305: v9.15,18.6 9.6,18.55 10.15,18.55 11.7,17 | 22.39,17 ISP.6
51_MOSI  (via drill 0.4)
  Top 0.305: U2.21 8.24,20.01 8.75,19.75 8.85,19.75 v9.8,19.5
  Bottom 0.25: 16.8,18.8 10.8,18.8
  Bottom 0.305: ISP.3 25.77,18.5 17.1,18.5 16.8,18.8 | 10.8,18.8 10.6,18.9 10.6,19.5 v9.8,19.5
52_SCLK  (via drill 0.4)
  Top 0.254: 9.1,20.3 10,20.3
  Top 0.305: U2.20 8.51,20.5 8.9,20.3 9.1,20.3 | 10,20.3 v10.6,20.3
  Bottom 0.305: v10.6,20.3 10.35,20.25 10.3,20.2 11.1,20.2 11.1,19.3 17.2,19.3 17.5,19 27.1,19 29.4,16.7 29.4,15.13 ISP.4
+3V3  (via drill 0.4)
  Top 0.305: U1.10 U1.11 2.04,27.73 2.9,28.6 3.96,29.16 U1.3 4,31.5 v3.9,33.1
  Bottom 0.305: v3.9,33.1 3,32 C10.2
+5V  (via drill 0.4, 0.6)  (1 unrouted)
  Top 0.254: U2.10 8.75,25.5 9,25.25 v10.25,25.25 | 10,30 9.3,30.7 9.1,30.8 9,30.8 9,31
  Top 0.305: 9,31 U2.100 | v18,34.3 18.7,33.2 18.99,32.61 U2.80 19,31.73 19,30.8 19.8,30 21.5,30 21.5,23 21.51,23.01 | 21.51,23.01 U2.61 | U2.31 11.5,17.5 v12,18.1 | 21.51,23.01 21.51,18.51 21,18 v20.5,17.7 | 10,30 v10.25,29.9 10.5,29.65 10.5,29 v14.2,29 | U2.10
  Top 0.406: D11.A 40.88,16.85 IC2.4 | R32.2 41.15,14.5 41.5,15 41.6,15.1 v42,15.3
  Top 0.61: ISP.5 25.77,16.27 26,16.5 | 27,17.5 31.5,17.5 32,17 32,16.5 v32.5,16.5 | 27,17.5 26,16.5 | 26,16.5 arc-90 25.75,16.25 23.75,16.25 23,17 22.75,17 22.5,17.25 21.75,17.25 21,18 | 27,17.5 27,18.98 D3.C
  Top 0.813: v42,15.3 IC2.4 42,23.12 IC2.2 42,23.18 42,26 38.5,29.5 v37.5,29.5 | 20.98,9.82 21,9.8 21,8.5 24.4,5.1 36.4,5.1 40,1.5 42.5,1.5 | 42.5,1.5 59,1.5 61,3.5 61.5,3.5 61.5,7 60,8.5 60.43,8.5 60.5,8.57 | J8.1 42.69,1.81 42.5,1.5 | 60.57,8.57 60.5,8.57 | 60.5,8.57 J5.3
  Top 1.016: 20.98,9.82 SJ3.3 | 60.57,8.57 66.04,14.04 J1.1
  Bottom 0.254: v10.25,25.25 9,25.25 8.5,25.75
  Bottom 0.305: 8.5,25.75 8,26 | 8,26 10.25,28.25 v10.25,29.9 | D10.2 17.35,33.5 v18,34.3 17.5,33.5 19,35 C12.2 | C14.2 5.5,26.5 7.5,26.5 8,26 | v12,18.1 12.4,17.7 v20.5,17.7 | 17,33.5 16,34.5 14.6,34.5 14.2,34.1 14.2,30.7 14.5,30 v14.2,29
  Bottom 0.406: R31.2 v10.25,29.9 | 17,33.5 17.5,33.5
  Bottom 0.61: v32.5,16.5 33.5,15.5 40.55,15.5 v42,15.3 | 12.2,45.2 17.1,45.2 19.7,44.5 20.6,44.5
  Bottom 0.813: J3.1 67.24,24.76 69,23 69,15.5 67.6,14.1 66.16,14.1 J1.1 | CTRLS.1 12.2,45.45 12.2,45.2 | 20.6,44.5 21.5,44.45 25.55,44.45 28.5,41.5 32,41.5 34.5,39 34.5,36.5 36,35 36,31 v37.5,29.5 | 58.47,8.5 J5.3 58.33,8.5 54,8.5
  Bottom 1.016: 54,8.5 52.5,10 51,10 49,12 45,12 v42,15.3
A2  (via drill 0.4)
  Top 0.25: 15.5,29 15.5,30.5 12.99,30.5 11.49,30.5
  Top 0.305: J4.2 74.04,21 72,21 69.5,18.5 69.5,17 68,15.05 56.5,15.05 55,13.5 v49.5,13.5 | v19.7,27.5 18.2,29 15.5,29 | 11.49,30.5 U2.95
  Bottom 0.305: v19.7,27.5 24,27.5 29,22.5 37,22.5 41,22.5 44.5,19 48,19 49.5,17.5 v49.5,13.5
A3  (via drill 0.4)
  Top 0.305: v10.9,35 10.9,34.9 11,35 11,33 12,33 U2.94
  Bottom 0.305: CTRLS.7 8.35,36.65 10,35 v10.9,35 | 11,35 v10.9,35 | R18.1 18.15,35 v10.9,35
A4  (via drill 0.4)
  Top 0.305: v11.8,34.3 11.81,33.61 11.81,33.51 12.5,33.5 U2.93
  Bottom 0.305: v11.8,34.3 9.7,34.3 7,37 7,39.09 CTRLS.6
A5  (via drill 0.4)
  Top 0.305: v13,34.2 12.99,33.19 U2.92
  Bottom 0.305: CTRLS.5 6.5,40.37 6.5,36.5 9.5,33.5 13,33.5 v13,34.2
A6
  Top 0.305: U2.91 13.5,33.5 14,34 14,35 12.5,36.5 12.5,43.5 13,44 J10.2
A7
  Top 0.305: U2.90 14,33 14.5,33.5 14.5,35.5 13,37 13,40 14.46,41.46 J10.1
A14  (via drill 0.4)
  Top 0.305: U2.83 17.49,30.41 v17.2,30.3
  Bottom 0.305: 19.15,32 C11.1 18,30 v17.2,30.3 16.4,30.5 D10.3 | 19.15,32 R6.2 | 19.15,32 19.3,31.65 R5.1
AKKU+IN  (via drill 0.6)
  Top 0.305: 19.5,6.5 SJ3.1 | v21.5,4.5 22,4.2
  Top 0.406: v21.5,4.5 19.5,6.5 | v48,10 v50.5,12.5 | v46.5,34.5 46.5,35 47,35.5 | 22,4.2 33,4.2 33.5,3.5 v35.5,3.5
  Top 0.61: 47,35.5 48,36.5
  Top 1.016: 48,36.5 Q1.2
  Bottom 0.254: R39.2 46,33.5 v46.5,34.5 47,34
  Bottom 0.305: 52,16.5 54.15,18.65 R14.2
  Bottom 0.406: R29.1 R26.1 36,5 | 36,5 40.5,5 44.5,9 47,9 v48,10 | v50.5,12.5 52,14 52,16.5 49,19.5 49,32 47,34 | v35.5,3.5 36,4 36,5
  other vias: 67.5,47 67.5,45.5 69,46 67.5,44 67.5,42.5 67.5,41 66,41.5 66,43 66,44.5 66,46 64.5,41 64.5,42.5 64.5,44 63,41.5 63,43 63,44.5 61.5,44 61.5,42.5 60,43.5 60,45 58.5,46 57,47 57,45.5 55.5,47 54,47 52.5,47 51,47 49.5,47 49.5,45.5 51,45.5 52.5,45.5 54,45.5 55.5,45.5 69,44.5 69,43 69,41.5
  pour Top (no thermals): 77,39.5 67.5,39.5 66,38 49.5,38 48.5,39 48.5,48 77,48
  pour Bottom (no thermals): 77,39.5 61.5,39.5 58,44 48.5,44 48.5,48 77,48
AKKU+OUT  (via drill 0.4, 0.6, 1)
  Top 0.254: v47.5,46.8 47.5,45.36 IC4.3 IC3.5 | C30.1 45.35,45.51 IC3.5 | IC3.5 45.55,44.05 v45.5,44
  Top 1.016: C6.1 23.2,33.4 v22.2,33.4 20.1,33.4 19.4,34.1 19.4,36.9 19.64,37.14 U11.P$2 | 65.5,33.4 65,32.5 62,29.5 49.7,29.5 v47.2,26.5
  Top 1.27: v24.8,30 C6.1
  Bottom 0.254: RS4.2 65.3,35.7 58.5,42.5 58.5,44 58,44.5 48.26,44.5 IC4.3 47.45,45.95 v47.5,46.8 | v45.5,44 45.5,42.74 IC4.5
  Bottom 0.305: R5.2 21.45,33.4 v22.2,33.4
  Bottom 1.27: v47.2,26.5 28.5,26.5 v24.8,30
  other vias: 63.5,36.5 65,36.5 66.5,36.5 63.5,35 63.5,33.5 67,35 67,33.5 67,32 68.5,32 68.5,33.5 68.5,35
  pour Bottom (no thermals): 62.5,39 62.5,31 69.5,31 71,29.5 77,29.5 77,39
  pour Top (no thermals): 76.5,38.8 67.9,38.9 66.5,37.5 62.5,37.5 62.5,30.5 76.5,30.5
AKKU+SHUNT  (via drill 0.6)
  Top 0.254: IC4.4 47.45,41.55 v47.5,41.2
  Bottom 0.254: R44.2 56.65,41.15 58,42.5 58,43.5 57.5,44 48.76,44 IC4.4 47.5,42.64 v47.5,41.2
  Bottom 0.406: D16.A 55.95,33.6 R43.1 59.2,33 RS3.1 59.7,36.8 57.5,39 57.5,40.15 R44.2
  other vias: 55,31 59,31 60.5,31 61.5,32 61.5,33.5 61.5,35 58,35
  pour Top (no thermals): 54.5,30 54.5,35 55,35.5 62,35.5 62,31 61,30
  pour Bottom (rank 2, no thermals): 54.5,30 54.5,35 55,35.5 62,35.5 62,31 61,30
BMS_SWITCH  (via drill 0.6)
  Top 0.406: SJ1.3 14.72,3 15.5,3 17,4.5 v18.5,5
  Bottom 0.406: v18.5,5 18.5,8 D5.A
CURRENT+  (via drill 0.6)
  Top 0.254: R33.2 C28.1 44.65,41.79 | 44.65,41.79 IC3.1 | 44.65,41.79 44.65,41.85 40.9,45.6 v27.5,45.6
  Top 0.305: v27.5,45.6 25.6,45.6 v22.5,42.5 | v18.5,38.5 18.5,36 17,34.5 17,34 18,33 U2.82
  Bottom 0.305: v22.5,42.5 v18.5,38.5
CURRENT-  (via drill 0.6)
  Top 0.305: v30.5,46.5 25.4,46.5 22.8,43.9 22.6,43.9 v21.2,42.5 | v16.5,35.9 16.5,33.5 17,33 U2.84
  Bottom 0.254: IC4.1 43.04,45.31 C9.1 R30.2 35.15,45.35 34,46.5 v30.5,46.5
  Bottom 0.305: v21.2,42.5 17.5,39 17.5,37 v16.5,35.9
DISPLAYSWITCH1
  Bottom 0.305: D14.C 12.5,7.55 12.5,10 12.32,10.18 DISPLAY.2
GND  (via drill 0.4, 0.5)
  Bottom 0.406: 50,41 50,39.5 | 50,39.5 46.85,39.5 C28.2 | U3.9 50.23,39.27 50,39.5
  Bottom 0.61: C13.1 52,43 50,41
  other vias: 24,37.5 25,37.5 24,36.5 25,36.5 24,35.5 25,35.5 1.5,43.5 1.5,41.5 1.5,39.5 20.7,29.1 14.3,25.4 17.3,22.4 1.5,16 3.5,17 44,21 24.2,22.8 20.5,22.6
  pour Top (rank 2, no thermals): 0,48 0,0 77,0 77,29.5 70,29.5 70,30 48.5,30.5 48.5,48
  pour Bottom (no thermals): 0,48 0,0 77,0 77,29 70,29 68.5,30.5 48,30.5 48,48
INT6  (via drill 0.4)
  Top 0.305: J4.4 76.1,24.34 76.1,22.5 71.75,22.5 68.5,19.25 68.5,16.5 67.6,15.55 55.55,15.55 54.45,14.5 49,14.5 48.5,14 v48,14 | U2.8 8.49,26.49 8.8,26.8 9.55,26.8 10.25,27.5 15,27.5 18.8,23.7 18.8,21.3 v20.3,19.75
  Bottom 0.305: v48,14 44.5,14 38.5,20 22,20 v20.3,19.75
INT7  (via drill 0.4)
  Top 0.305: U2.9 v9.3,26
  Bottom 0.254: v9.3,26 10.5,26 11,25.7
  Bottom 0.305: 11,25.7 11.7,25.7 12,26 | 12,26 12.15,26.15 R10.1 | C7.1 12,24.65 12,26
N$1
  Bottom 1.016: J6.2 57.11,16.57 T3.1
N$2  (via drill 0.5)
  Top 0.305: U11.P$4 21.4,34.5 24,34.5 v24.5,34
  Bottom 0.305: v24.5,34 24.15,33.65 R4.2
N$3  (via drill 0.4)
  Top 0.254: 4.5,22.4 4.8,22.4 v5.3,22.85
  Top 0.305: JUSB.1 4.5,22.4
  Top 0.406: U1.12 2.69,25.11 v4.35,24.95
  Top 0.61: D3.A 24.52,24.02 v24.5,24
  Bottom 0.25: 10.85,24.25 10.9,24.3 | 10,24.3 9.4,24.8
  Bottom 0.254: 11.25,23.15 10.85,24.25 | 10.9,24.3 10,24.3 | 9.4,24.8 8.5,24.8 8.2,25.3 6.9,25.3 7,25.25
  Bottom 0.305: 7,25.25 5.5,25.25 | v5.3,22.85 5,23.5 5,24.5 5.25,24.75 5.25,25 5.5,25.25 | 5.5,25.25 4.75,25.25 v4.35,24.95
  Bottom 0.406: C16.1 5,23.8 5,23.5
  Bottom 0.61: v24.5,24 21,24 20.5,24.5 17.3,24.5 17.3,23.5 14.75,23.5 14.5,23.15 11.25,23.15
N$4  (via drill 0.4)
  Top 0.254: 10,31 10.15,30.65 10.85,30.65
  Top 0.305: U2.98 10,31 | 10.85,30.65 11,30.5 11.2,29.8 v11.65,29.75
  Bottom 0.305: v11.65,29.75 12,29.35 C1.1
N$5
  Bottom 0.61: T4.1 40.99,1 44,1 45.23,2.23 J8.2
N$6  (via drill 0.4)
  Top 0.305: U1.2 4.58,32.58 v5,33.1
  Bottom 0.305: C20.1 5.15,33.1 v5,33.1 5.75,33.1 R13.1
N$7  (via drill 0.4)
  Top 0.406: v1.9,28.7 0.77,28.07 U1.9
  Bottom 0.305: R3.1 2.15,22.15 1.8,22.5 1.8,25 1.85,25.75 1.85,28.5 2,28.75 v1.9,28.7
N$8  (via drill 0.4)
  Top 0.305: v1.15,29.6 1.3,29.55 1.2,29.6 0.75,30.25 U1.8
  Bottom 0.305: 2.15,20.35 R9.1 2,20 1.25,20.75 1.25,27.25 1.15,27.85 1,28.5 1,29.25 v1.15,29.6
N$9  (via drill 0.4)
  Top 0.305: U1.1 5.24,30.07 v4.8,29.75
  Bottom 0.305: v4.8,29.75 R1.2
N$10  (via drill 0.4)
  Top 0.406: JUSB.2 5.35,21.65 v5.3,21.8
  Bottom 0.406: v5.3,21.8 5.3,22 R3.2
N$11
  Top 0.406: R32.1 42.85,12.85 C2.1
N$12  (via drill 0.4)
  Top 0.305: U1.4 3.31,30.3 v3.1,29.75
  Bottom 0.305: v3.1,29.75 3,29.5 4.5,28 R7.2
N$13  (via drill 0.6)
  Top 0.406: v29,29.5 27.8,29.5 R21.3
  Bottom 0.406: R22.1 31,31 31,30 29,30 v29,29.5
N$14  (via drill 0.4)
  Top 0.305: v47.5,18 52.27,18 55,20.73 55,20.75 55.95,21.8 55.95,23.25 57.33,24.63 J2.1
  Bottom 0.305: R10.2 24,26.5 28.5,22 36.5,22 40.5,22 44.5,18 v47.5,18
N$15  (via drill 0.4)
  Top 0.254: JUSB.3 5.2,21 v5.3,20.7
  Bottom 0.406: v5.3,20.7 4.6,20 R9.2
N$16
  Bottom 0.406: D1.A D13.A
N$17
  Bottom 0.305: R20.1 C18.1
N$18  (via drill 0.4)
  Top 0.305: U11.P$6 29.28,35.9 v29.4,35.9
  Bottom 0.305: R20.2 30.75,35.9 | 30.75,35.9 C17.1 | v29.4,35.9 30.75,35.9
N$19  (via drill 0.4)
  Top 0.305: BUZZER.+ 29.1,9.9 27.5,11.5 26,11.5 22.5,15 22.5,15.5 v22,16 | v8.8,17.7 8.31,18.49 U2.24
  Bottom 0.305: v22,16 10,16 10,16.5 v8.8,17.7
N$24
  Bottom 0.254: T1.1 24.99,2.5 26.5,2.5 28.3,4.3 30.3,4.3 31,3.5 R34.2
N$25
  Bottom 0.406: U3.8 42.83,41 R37.1
N$28  (via drill 0.4)
  Top 0.305: U11.P$5 29,34.6 v29,34.1
  Bottom 0.305: v29,34.1 29.15,34 R23.2 R22.2
N$29
  Bottom 0.305: D5.C D4.C 24.55,8 R15.1
N$30
  Bottom 0.406: U3.7 44.52,38.6 43.4,38.6 42.5,39.5 R35.1
N$31  (via drill 0.4)
  Top 0.305: J1.3 65.07,20.4 57.05,20.4 52.5,15.7 v48.2,15.7
  Bottom 0.305: R11.1 C3.1 16.5,21.5 20.5,21.5 21,21 39.2,21 44.1,16.1 44.4,15.7 v48.2,15.7
N$32  (via drill 0.4)
  Top 0.305: v47,15 54,15 56.8,17.95 64.79,17.95 J1.2
  Bottom 0.305: R12.1 C4.1 18.7,20.3 19.5,20.5 38.8,20.5 44.3,15 v47,15
N$33  (via drill 0.5)
  Top 0.305: v25.7,39.9 27.05,41
  Top 1.27: U9.P$1 27.56,38.41 U11.P$8 27.05,41 27.05,41.95 D7.C
  Bottom 0.305: C19.2 v25.7,39.9
N$34
  Top 0.813: DISPLAY.1 8.4,11.5 12.5,11.5 13,11 13,8.5 13.8,7.7 17.8,7.7 SJ3.2
N$35
  Bottom 0.305: J7.1 58.23,19.5 R14.1
N$37
  Top 0.813: D2.C 29.7,19.93 31.9,19.3 32.92,18.27 34.98,18.27 34.98,18.56 C27.1 | IC2.3 39.69,22.99 39.4,22.99 C27.1 | D11.C 35,15.53 C27.1
N$38
  Bottom 0.406: R36.1 42.02,37.33 U3.5
N$40
  Bottom 0.406: U3.4 43.67,36.67 43,36 R38.1
N$41
  Bottom 0.406: C5.2 44.55,33.4 U3.1
N$42
  Bottom 0.305: T2.1 21.01,6 D1.C 23.53,4.52 T1.3 24.48,4.52 25.5,3.5 26.5,3.5 27.8,4.8 30.7,4.8 31.5,5 R26.2
N$44  (via drill 0.5)
  Top 0.305: U11.P$1 21.3,39.3 v22,40
  Bottom 0.305: v22,40 22.15,40 C19.1
N$45
  Bottom 0.406: U3.2 43.38,35.38 42.5,34.5 C8.2 42,34.35 42,32 42.85,31.15 C5.1 R39.1
N$46  (via drill 0.6)
  Top 0.305: 45.5,11.5 43.5,9.5 v42.5,9.5
  Top 0.406: 45.5,11.5 45.5,22 | 45.5,22 v45.5,28.5 | v51.5,22 45.5,22
  Bottom 0.254: v45.5,28.5 44.5,29.5 41,29.5 38.5,32 C29.2 | T1.2 26.42,5 27,5 28,6 28.75,6 | 28.75,6 D13.C | 28.85,5.9 28.75,6
  Bottom 0.305: T1.2 | 28.85,5.9 R15.2 27,7.15 30.7,7.15 31.4,7.85 R25.2 40.85,7.85 v42.5,9.5
  Bottom 0.406: U3.6 43.02,37.98 42.5,38.5 38.65,38.5 C29.2 36.6,38.65 D17.C 36.6,38.35 | J7.2 58.27,22 v51.5,22
N$47
  Top 0.406: DISPLAY.6 11.69,4.3 SJ1.2
N$48
  Bottom 0.406: D15.A 55.95,39.4 R42.2
N$49
  Bottom 0.254: 20.5,4 D6.C | D6.C D12.C | D6.C D14.A
  Bottom 0.305: 20.5,4 20.99,3.51 T2.3 23.02,2.98 25.2,0.8 29.8,0.8 31.5,2 R29.2
N$51
  Bottom 0.406: U3.11 50.98,37.98 51.5,38.5 51.5,39.5 52.65,40.65 R42.1 54.35,42.7 C13.2 56.35,43 R44.1
N$52  (via drill 0.6)
  Top 0.406: Q1.1 51.95,33.95
  Top 0.813: 54,36.5 v58.3,36.5
  Top 1.27: 51.95,33.95 54,36.5
  Bottom 0.406: v58.3,36.5 58,37 R40.2
N$53
  Bottom 0.406: R40.1 R41.2 53.85,35.8 D16.C 53.05,33.6 R43.2
N$54
  Bottom 0.406: U3.12 51.83,37.33 R41.1 52.15,38.1 D15.C
N$56  (via drill 0.4)
  Top 0.305: U2.33 v12.51,14.49 v12.5,14.5
  Bottom 0.305: v12.5,14.5 14,13 16.6,13 18.1,11.5 Y1.1 20.85,12 R27.1
PH2  (via drill 0.4, 0.5)
  Top 0.305: v8.6,23.6 8.4,23.6 8.3,23.5 U2.14
  Top 0.406: SJ1.1 11.32,9 10,9 8.9,10.1 7.2,10.1 7.2,12.9 v8.4,12.9
  Bottom 0.25: 8.7,21.5 9.8,22.1 9.8,22.3 | 9.8,22.7 9,23.5
  Bottom 0.305: v8.4,12.9 8,14 8,20.9 8.1,20.9 8.7,21.5 | 9.8,22.3 9.8,22.7 | 9,23.5 v8.6,23.6
RESET  (via drill 0.4)
  Top 0.305: v11,26.6 11.5,26.5 11.5,19 11,18.5 11.01,17.99 U2.30 11,13 13.75,13 v15,14.25 | ISP.2 30.54,11.96 v30.55,11.85
  Bottom 0.254: 11,30.5 11,28
  Bottom 0.305: C20.2 11,32.1 11,30.5 | 11,28 v11,26.6 | v15,14.25 15.25,14.25 16.1,14.1 16.8,14.1 17.5,14.7 22.7,14.7 23.5,14 23.5,13 24.95,11.85 v30.55,11.85
  Bottom 0.406: R31.1 11,30.85 11,30.5 | C15.1 11,28
V_LIGHT  (via drill 0.6)
  Top 0.813: D2.A 30,25.02 30,28.6 32.1,29.7 32.1,31.81 C26.1 33,31.91 | 33,31.91 49.59,31.91 v50,31.5 | v33.1,33 33,31.91
  Bottom 0.406: 68,31 71,28
  Bottom 0.61: 64.5,31 68,31
  Bottom 0.813: J4.1 72.62,18.62 71,17 | 71,17 70,16 70,15 67.5,12.5 62,12.5 60.5,14 58.43,14 J6.1 | v50,31.5 52.5,29 62.5,29 64.5,31 | 71,28 71,17 | R23.1 v33.1,33
  pour Top (no thermals): 30.5,30 30.5,34.5 35.5,39.5 35.5,42.5 37.5,44.5 40.5,44.5 42,43 42,37.5 41.5,37 40,37 34,31 34,30.5 33,29.5 31,29.5
XTAL1  (via drill 0.4)
  Top 0.305: v13.6,14.9 13,15.2 U2.34
  Bottom 0.305: v13.6,14.9 13.6,14.4 14.5,13.5 17,13.5 17.5,13.9 Y1.3 19.15,13.85 R27.2

### Text on the board
tNames: + IN | GND | +OUT | I | V | U11 | - | BK | S | BN | + | REV 2.3 | - | - | BE | - | GY | Forumscontroller | Mot | WE | - | Brk | + | + | - | 5V | -IN | + | -OUT | BAT | + | - | RX | TX | - | NML | jenkie 2020 | SDA | SCL | + | BMS | www.pedelecforum.de
bNames: Forumscontroller / Rev. 2.3 / / SN